# EAGLE design tommyprom (EAGLE 9.6.2)
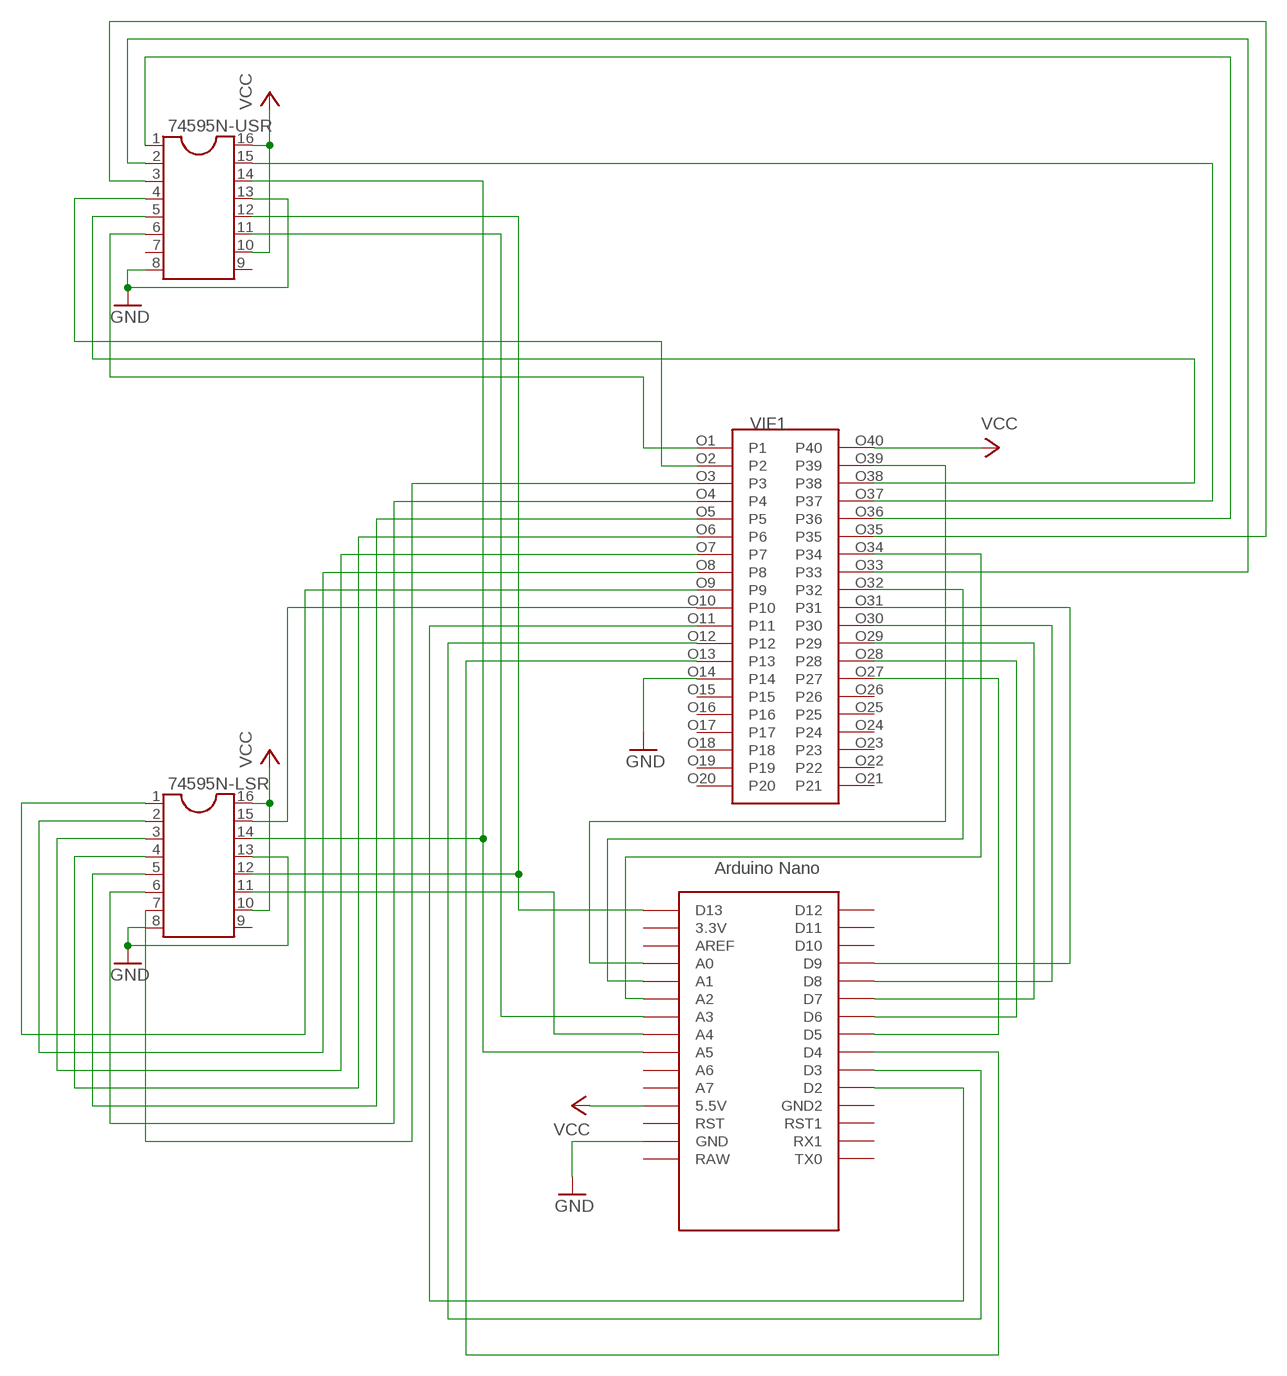
[diagram p0: schematic, sheet 1]

## Parts
74595N-LSR  DIL16S  [SOCKET-16]
74595N-USR  DIL16S  [SOCKET-16]
U$1  NANO  [NANO]
VIF1  40-6554-10DIP  [40-6554-10]

## Nets
GND: 74595N-LSR.8 74595N-LSR.13 74595N-USR.8 74595N-USR.13 U$1.GND VIF1.O14(P14)
N$1: 74595N-USR.15 VIF1.O37(P37)
N$2: 74595N-USR.5 VIF1.O38(P38)
N$3: 74595N-LSR.12 74595N-USR.12 U$1.D13
N$4: 74595N-USR.3 VIF1.O35(P35)
N$5: 74595N-USR.11 U$1.A3
N$6: 74595N-LSR.14 74595N-USR.14 U$1.A5
N$7: 74595N-USR.6 VIF1.O1(P1)
N$8: 74595N-USR.1 VIF1.O36(P36)
N$9: 74595N-LSR.15 VIF1.O10(P10)
N$10: 74595N-LSR.1 VIF1.O9(P9)
N$11: 74595N-LSR.2 VIF1.O8(P8)
N$12: 74595N-LSR.3 VIF1.O7(P7)
N$13: 74595N-LSR.4 VIF1.O6(P6)
N$14: 74595N-LSR.5 VIF1.O5(P5)
N$15: 74595N-LSR.6 VIF1.O4(P4)
N$16: 74595N-LSR.7 VIF1.O3(P3)
N$17: U$1.A0 VIF1.O39(P39)
N$18: U$1.A1 VIF1.O32(P32)
N$19: U$1.A2 VIF1.O34(P34)
N$21: 74595N-LSR.11 U$1.A4
N$23: 74595N-USR.2 VIF1.O33(P33)
N$25: 74595N-USR.4 VIF1.O2(P2)
N$29: U$1.D2 VIF1.O11(P11)
N$30: U$1.D3 VIF1.O12(P12)
N$31: U$1.D4 VIF1.O13(P13)
N$32: U$1.D5 VIF1.O27(P27)
N$33: U$1.D6 VIF1.O28(P28)
N$34: U$1.D7 VIF1.O29(P29)
N$35: U$1.D8 VIF1.O30(P30)
N$36: U$1.D9 VIF1.O31(P31)
VCC: 74595N-LSR.10 74595N-LSR.16 74595N-USR.10 74595N-USR.16 U$1.5V(5.5V) VIF1.O40(P40)
Unconnected: 74595N-LSR.9 74595N-USR.7 74595N-USR.9 U$1.3.3V U$1.A6 U$1.A7 U$1.AREF U$1.D10 U$1.D11 U$1.D12 U$1.GND1(GND2) U$1.ICSP1 U$1.ICSP2 U$1.ICSP3 U$1.ICSP4 U$1.ICSP5 U$1.ICSP6 U$1.RAW U$1.RST U$1.RST1 U$1.RX1 U$1.TX0 VIF1.O15(P15) VIF1.O16(P16) VIF1.O17(P17) VIF1.O18(P18) VIF1.O19(P19) VIF1.O20(P20) VIF1.O21(P21) VIF1.O22(P22) VIF1.O23(P23) VIF1.O24(P24) VIF1.O25(P25) VIF1.O26(P26)

## Library data of the parts
74595N-LSR 74595N-USR = ic-package:DIL16: Dual In Line / Socket
U$1 = Arduino-clone:NANO: Arduino Nano
VIF1 = personal:40-6554-10: 40 pin VIF Socket for PROM and IC devices Documention <http://www.farnell.com/datasheets/56801.pdf>

## Board
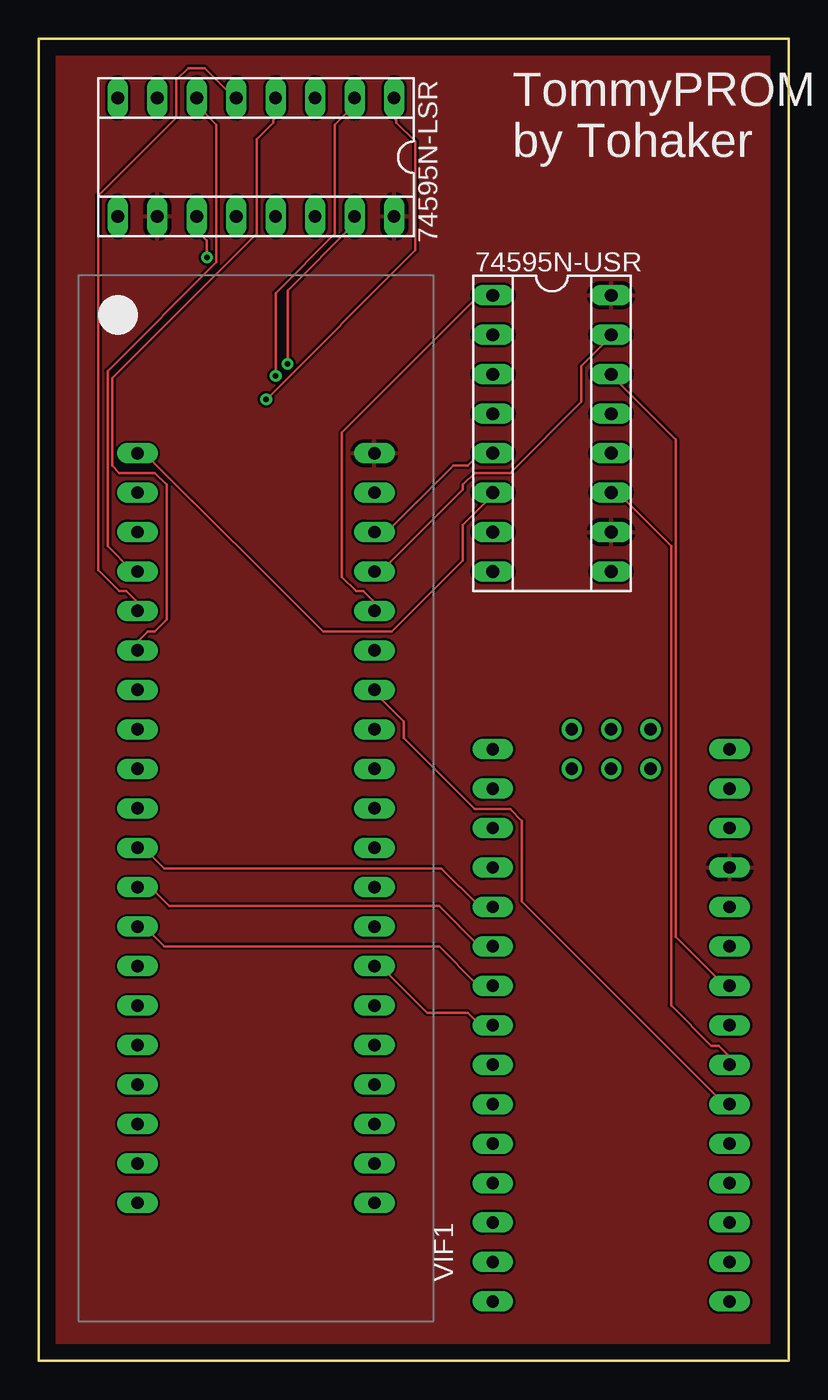
[diagram p1: board, top side]
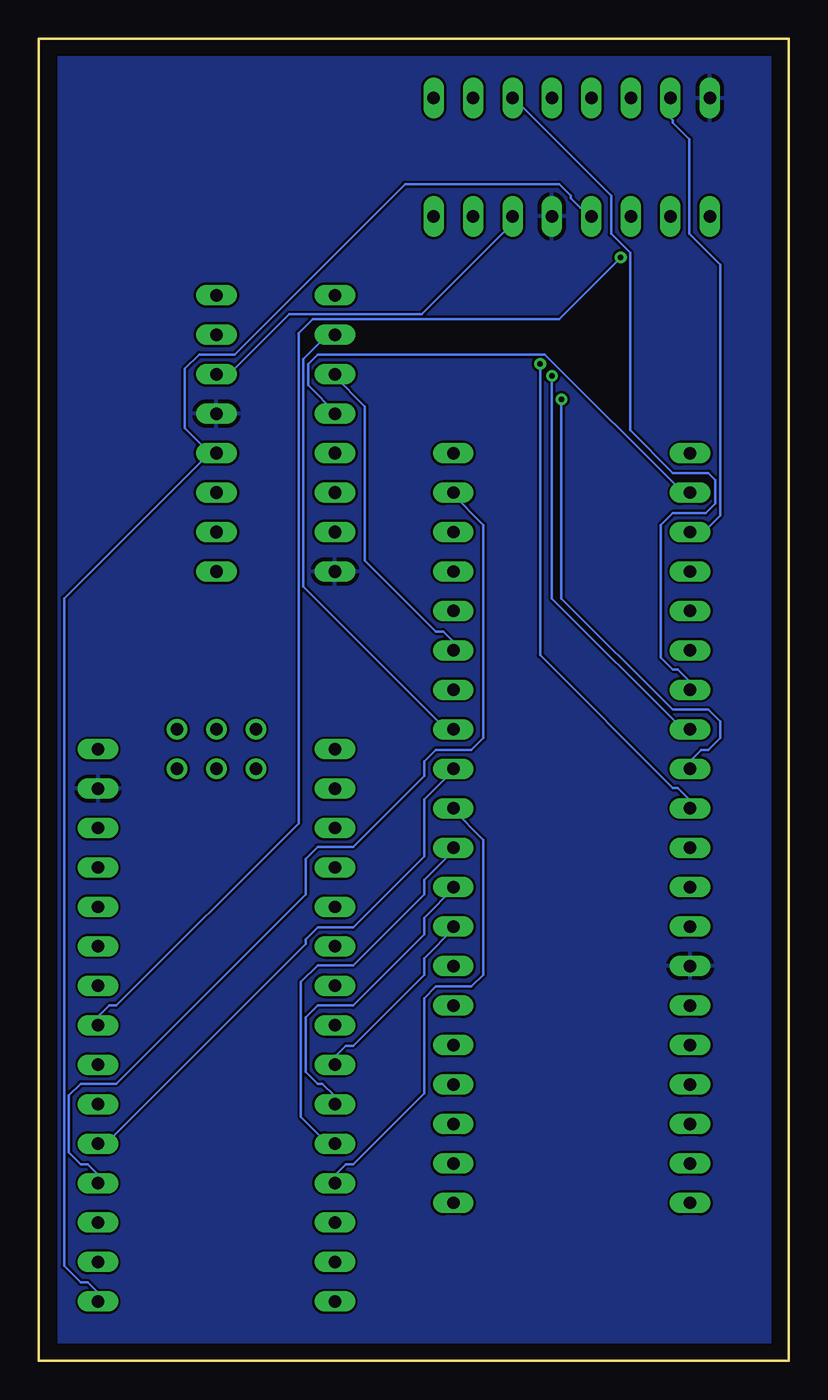
[diagram p2: board, bottom side, seen from below]

Size 48.26 x 85.09 mm. Coordinates in mm from the lower left corner, seen from the top.
Outline: 0,0 0,85.09 48.26,85.09 48.26,0 0,0
Copper layers (1*16): Top 0.035mm / dielectric 1.5mm / Bottom 0.035mm
Design rules "default": minimum track width 6mil, minimum drill 0.35mm, track to track 6mil, track to pad 6mil, pad to pad 6mil, via to via 6mil, smd to smd 6mil, copper to edge 40mil, drill to drill 6mil, minimum pad ring 10mil, minimum via ring 8mil, stop-mask expansion 4mil, vias tented up to drill 0mil, thermal gap 10mil

### Footprints (pad centres in the part's own frame; a part is rotated, then mirrored left to right if it is on the bottom)
SOCKET-16 = drill 0.813 long: 1 -8.89,-3.81; 2 -6.35,-3.81; 3 -3.81,-3.81; 4 -1.27,-3.81; 5 1.27,-3.81; 6 3.81,-3.81; 7 6.35,-3.81; 8 8.89,-3.81; 9 8.89,3.81; 10 6.35,3.81; 11 3.81,3.81; 12 1.27,3.81; 13 -1.27,3.81; 14 -3.81,3.81; 15 -6.35,3.81; 16 -8.89,3.81
NANO = drill 0.8 long: 3.3V -10.16,24.13; 5V -10.16,-1.27; A0 -10.16,19.05; A1 -10.16,16.51; A2 -10.16,13.97; A3 -10.16,11.43; A4 -10.16,8.89; A5 -10.16,6.35; A6 -10.16,3.81; A7 -10.16,1.27; AREF -10.16,21.59; D2 5.08,1.27; D3 5.08,3.81; D4 5.08,6.35; D5 5.08,8.89; D6 5.08,11.43; D7 5.08,13.97; D8 5.08,16.51; D9 5.08,19.05; D10 5.08,21.59; D11 5.08,24.13; D12 5.08,26.67; D13 -10.16,26.67; GND -10.16,-6.35; GND1 5.08,-1.27; RAW -10.16,-8.89; RST -10.16,-3.81; RST1 5.08,-3.81; RX1 5.08,-6.35; TX0 5.08,-8.89 | drill 0.8: ICSP1 -5.08,-10.16; ICSP2 -5.08,-7.62; ICSP3 -2.54,-10.16; ICSP4 -2.54,-7.62; ICSP5 0,-10.16; ICSP6 0,-7.62
40-6554-10 = drill 0.8 long: O1 -24.13,-7.62; O2 -21.59,-7.62; O3 -19.05,-7.62; O4 -16.51,-7.62; O5 -13.97,-7.62; O6 -11.43,-7.62; O7 -8.89,-7.62; O8 -6.35,-7.62; O9 -3.81,-7.62; O10 -1.27,-7.62; O11 1.27,-7.62; O12 3.81,-7.62; O13 6.35,-7.62; O14 8.89,-7.62; O15 11.43,-7.62; O16 13.97,-7.62; O17 16.51,-7.62; O18 19.05,-7.62; O19 21.59,-7.62; O20 24.13,-7.62; O21 24.13,7.62; O22 21.59,7.62; O23 19.05,7.62; O24 16.51,7.62; O25 13.97,7.62; O26 11.43,7.62; O27 8.89,7.62; O28 6.35,7.62; O29 3.81,7.62; O30 1.27,7.62; O31 -1.27,7.62; O32 -3.81,7.62; O33 -6.35,7.62; O34 -8.89,7.62; O35 -11.43,7.62; O36 -13.97,7.62; O37 -16.51,7.62; O38 -19.05,7.62; O39 -21.59,7.62; O40 -24.13,7.62

### Placement (x,y rotation side)
74595N-LSR  13.97,77.47 180 top
74595N-USR  33.02,59.69 270 top
U$1  34.29,30.48 180 top
VIF1  13.97,34.29 270 top

### Tracks (layer width: path | path; a pad name or v marks a point on that pad's centre or on a via)
GND
  pour Bottom: 0,85.09 0,0 46.99,0 46.99,85.09
N$1
  Top 0.152: VIF1.O37 21.64,50.9 22.1,50.9 27.28,56.08 27.28,56.39 28.04,57.15 30.33,57.15 34.9,61.72 34.9,64.01 36.88,65.99 74595N-USR.15
N$2
  Top 0.152: VIF1.O38 22.4,53.34 26.67,57.61 27.58,57.61 28.35,58.37 29.11,58.37 74595N-USR.5
N$3
  Bottom 0.152: 37.19,58.37 36.88,58.37 74595N-USR.12 37.19,58.37 | 37.19,58.37 37.34,58.37 46.63,49.07 46.63,6.1 45.57,5.03 45.11,5.03 44.5,4.42 44.5,3.81 U$1.D13 | 74595N-LSR.12 13.26,74.22 13.41,74.22 14.02,74.83 14.02,74.98 14.78,75.74 24.69,75.74 35.66,64.77 37.95,64.77 38.86,63.86 38.86,60.05 37.19,58.37
N$4
  Bottom 0.152: VIF1.O35 21.64,45.72 21.64,46.33 22.25,46.94 22.71,46.94 27.28,51.51 27.28,61.42 29.26,63.4 74595N-USR.3
N$5
  Top 0.152: U$1.A3 44.35,19.05 44.35,19.66 43.74,20.27 43.28,20.27 40.69,22.86 40.69,52.43 37.34,55.78 36.88,55.78 74595N-USR.11
N$6
  Top 0.152: U$1.A5 44.35,24.23 44.04,24.23 41,27.28 41,59.28 36.88,63.4 74595N-USR.14
  Bottom 0.152: 74595N-LSR.14 17.83,73.61 17.83,73.15 23.62,67.36 32.16,67.36 35.97,63.55 36.73,63.55 74595N-USR.14
N$7
  Top 0.152: VIF1.O1 6.4,58.37 6.86,58.37 18.29,46.94 22.71,46.94 27.28,51.51 27.28,53.8 29.26,55.78 74595N-USR.6
N$8
  Top 0.152: 74595N-USR.1 28.35,68.58 19.51,59.74 19.51,50.44 20.42,49.53 20.88,49.53 21.49,48.92 21.49,48.31 VIF1.O36
N$9  (via drill 0.35)
  Top 0.152: v16,64.16 16,68.89 20.27,73.15 20.27,73.61 74595N-LSR.15
  Bottom 0.152: v16,64.16 16,45.41 7.47,36.88 7.16,36.88 6.4,36.12 6.4,35.66 VIF1.O10
N$10  (via drill 0.35)
  Top 0.152: v14.63,61.87 24.23,71.48 24.23,78.49 23.01,79.7 23.01,79.86 22.86,80.01 74595N-LSR.1
  Bottom 0.152: v14.63,61.87 14.63,49.07 7.47,41.91 5.18,41.91 4.42,41.15 4.42,40.08 5.18,39.32 5.64,39.32 6.25,38.71 6.25,38.1 VIF1.O9
N$11  (via drill 0.35)
  Top 0.152: v15.24,63.4 15.24,68.73 19.05,72.54 19.05,79.55 20.27,80.77 20.27,81.23 74595N-LSR.2
  Bottom 0.152: v15.24,63.4 15.24,49.07 6.86,40.69 6.4,40.69 VIF1.O8
N$12
  Bottom 0.152: VIF1.O7 6.4,43.28 6.4,43.74 7.16,44.5 7.47,44.5 8.23,45.26 8.23,53.8 7.47,54.56 5.33,54.56 4.72,55.17 4.72,56.69 5.18,57.15 7.47,57.15 10.21,59.89 10.21,71.32 11.43,72.54 11.43,74.98 17.68,81.23 74595N-LSR.3
N$13
  Top 0.152: 74595N-LSR.4 15.24,80.01 15.09,79.86 15.09,79.7 14.02,78.64 14.02,72.54 4.72,63.25 4.72,57.61 5.18,57.15 7.47,57.15 8.23,56.39 8.23,47.7 7.47,46.94 7.01,46.94 6.4,46.33 6.4,45.72 VIF1.O6
N$14
  Top 0.152: VIF1.O5 6.25,48.31 6.25,48.92 5.64,49.53 5.18,49.53 3.81,50.9 3.81,74.98 8.84,80.01 8.84,82.45 9.6,83.21 10.67,83.21 12.65,81.23 74595N-LSR.5
N$15
  Top 0.152: VIF1.O4 6.25,50.9 5.94,50.9 4.42,52.43 4.42,63.7 11.43,70.71 11.43,79.55 10.21,80.77 10.21,81.23 74595N-LSR.6
N$16
  Bottom 0.152: VIF1.O3 5.49,53.34 4.42,54.41 4.42,70.56 6.4,72.54 6.4,78.64 7.47,79.7 7.47,79.86 7.62,80.01 74595N-LSR.7
N$17
  Bottom 0.152: U$1.A0 44.5,11.43 44.5,12.04 45.11,12.65 45.57,12.65 46.33,13.41 46.33,17.07 45.57,17.83 43.28,17.83 31.09,30.02 31.09,32.31 30.33,33.07 28.04,33.07 23.47,37.64 23.47,38.56 22.71,39.32 20.42,39.32 19.66,40.08 19.66,53.8 21.64,55.78 VIF1.O39
N$18
  Bottom 0.152: U$1.A1 44.35,14.02 43.89,14.02 31.09,26.82 31.09,27.13 30.33,27.89 28.04,27.89 23.47,32.46 23.47,36.12 21.49,38.1 VIF1.O32
N$19
  Top 0.152: U$1.A2 44.35,16.61 44.04,16.61 31.09,29.57 31.09,34.75 30.33,35.51 28.04,35.51 23.47,40.08 23.47,41.15 21.49,43.13 VIF1.O34
N$21  (via drill 0.35)
  Top 0.152: v10.82,71.02 10.82,72.08 10.21,72.69 10.21,73.61 74595N-LSR.11
  Bottom 0.152: v10.82,71.02 14.78,67.06 30.63,67.06 31.55,66.14 31.55,34.59 43.28,22.86 43.74,22.86 44.35,22.25 44.35,21.64 U$1.A4
N$23
  Bottom 0.152: VIF1.O33 21.64,40.69 22.1,40.69 31.24,49.84 31.24,64.47 29.72,65.99 29.26,65.99 74595N-USR.2
N$25
  Bottom 0.152: VIF1.O2 6.4,55.93 6.86,55.93 15.7,64.77 30.33,64.77 30.94,64.16 30.94,62.79 29.11,60.96 74595N-USR.4
N$29
  Top 0.152: VIF1.O11 6.4,32.92 6.86,32.92 8.08,31.7 25.91,31.7 28.35,29.26 29.11,29.26 U$1.D2
N$30
  Top 0.152: VIF1.O12 7.16,30.48 8.38,29.26 25.76,29.26 28.35,26.67 U$1.D3
N$31
  Top 0.152: VIF1.O13 6.4,27.89 6.86,27.89 8.08,26.67 25.76,26.67 28.19,24.23 29.11,24.23 U$1.D4
N$32
  Top 0.152: VIF1.O27 21.64,25.3 22.1,25.3 24.99,22.4 27.58,22.4 28.35,21.64 29.11,21.64 U$1.D5
N$33
  Bottom 0.152: U$1.D6 29.11,19.05 29.11,19.66 28.5,20.27 28.04,20.27 23.47,24.84 23.47,25.91 21.49,27.89 VIF1.O28
N$34
  Bottom 0.152: U$1.D7 29.26,16.61 29.26,17.07 30.02,17.83 30.33,17.83 31.09,18.59 31.09,22.1 30.33,22.86 28.04,22.86 23.47,27.43 23.47,28.5 21.49,30.48 VIF1.O29
N$35
  Bottom 0.152: U$1.D8 29.26,14.02 29.72,14.02 31.39,15.7 31.39,24.38 30.33,25.45 28.04,25.45 23.47,30.02 23.47,30.94 21.49,32.92 VIF1.O30
N$36
  Bottom 0.152: U$1.D9 29.11,11.43 29.11,12.04 28.5,12.65 28.04,12.65 23.47,17.22 23.47,23.32 22.71,24.08 20.42,24.08 19.66,24.84 19.66,33.53 21.64,35.51 VIF1.O31
VCC
  pour Top: 0,85.09 0,0 46.99,0 46.99,85.09

### Text on the board
tPlace: TommyPROM / by Tohaker